# Altium project LPEDT.PrjPcb
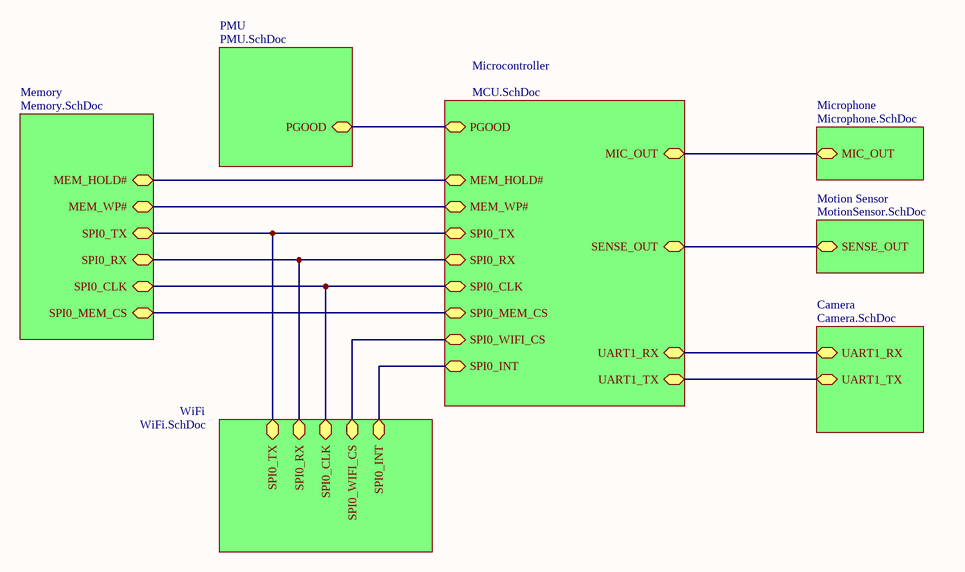
[diagram p0: TopLevel.SchDoc]
8 sheets, 87 parts. Net scope: hierarchical (ports join the sheet entries above them; power ports are global).
Board file: 3ER_PCB.PcbDoc
Sheets:
  TopLevel.SchDoc
    Microcontroller = MCU.SchDoc
    Camera = Camera.SchDoc
    Motion Sensor = MotionSensor.SchDoc
    Microphone = Microphone.SchDoc
    PMU = PMU.SchDoc
    Memory = Memory.SchDoc
    WiFi = WiFi.SchDoc

## Sheet TopLevel.SchDoc: Top-Level Schematic
size A3; Date: 10/18/2017; Author: Chase E Stewart; CompanyName: Three-Eyed Ravens; DrawnBy: Chase E Stewart; Organization: CU Boulder; DocumentNumber: 001; Revision: 1.1; SheetNumber: 1; SheetTotal: 8; Application_BuildNumber: 1.0

### Sub-sheets
Camera = Camera.SchDoc: UART1_RX, UART1_TX
Memory = Memory.SchDoc: SPI0_RX, SPI0_CLK, SPI0_MEM_CS, SPI0_TX, MEM_WP#, MEM_HOLD#
Microcontroller = MCU.SchDoc: UART1_RX, UART1_TX, MIC_OUT, SENSE_OUT, SPI0_WIFI_CS, SPI0_MEM_CS, SPI0_CLK, SPI0_RX, SPI0_TX, MEM_WP#, MEM_HOLD#, SPI0_INT, PGOOD
Microphone = Microphone.SchDoc: MIC_OUT
Motion Sensor = MotionSensor.SchDoc: SENSE_OUT
PMU = PMU.SchDoc: PGOOD
WiFi = WiFi.SchDoc: SPI0_TX, SPI0_RX, SPI0_CLK, SPI0_WIFI_CS, SPI0_INT

### Nets
MEM_HOLD#: sheet Microcontroller/MEM_HOLD#, sheet Memory/MEM_HOLD#
MEM_WP#: sheet Microcontroller/MEM_WP#, sheet Memory/MEM_WP#
SPI0_CLK: sheet Microcontroller/SPI0_CLK, sheet Memory/SPI0_CLK, sheet WiFi/SPI0_CLK
SPI0_INT: sheet Microcontroller/SPI0_INT, sheet WiFi/SPI0_INT
SPI0_MEM_CS: sheet Microcontroller/SPI0_MEM_CS, sheet Memory/SPI0_MEM_CS
SPI0_RX: sheet Microcontroller/SPI0_RX, sheet Memory/SPI0_RX, sheet WiFi/SPI0_RX
SPI0_TX: sheet Microcontroller/SPI0_TX, sheet Memory/SPI0_TX, sheet WiFi/SPI0_TX
SPI0_WIFI_CS: sheet Microcontroller/SPI0_WIFI_CS, sheet WiFi/SPI0_WIFI_CS
UART1_RX: sheet Microcontroller/UART1_RX, sheet Camera/UART1_RX
UART1_TX: sheet Microcontroller/UART1_TX, sheet Camera/UART1_TX
NetC26_1: sheet Microcontroller/MIC_OUT, sheet Microphone/MIC_OUT
NetP12_1: sheet Microcontroller/PGOOD, sheet PMU/PGOOD
NetR9_2: sheet Microcontroller/SENSE_OUT, sheet Motion Sensor/SENSE_OUT

### Notes on the sheet
- Title
- Size:
- Date:
- A3
- Number:
- Time:
- Revision:
- Sheet
- of
- File:

## Sheet MCU.SchDoc: MCU
size A3; Organization: CU Boulder; DocumentNumber: 003; Revision: 1.1; SheetNumber: 3; SheetTotal: 8
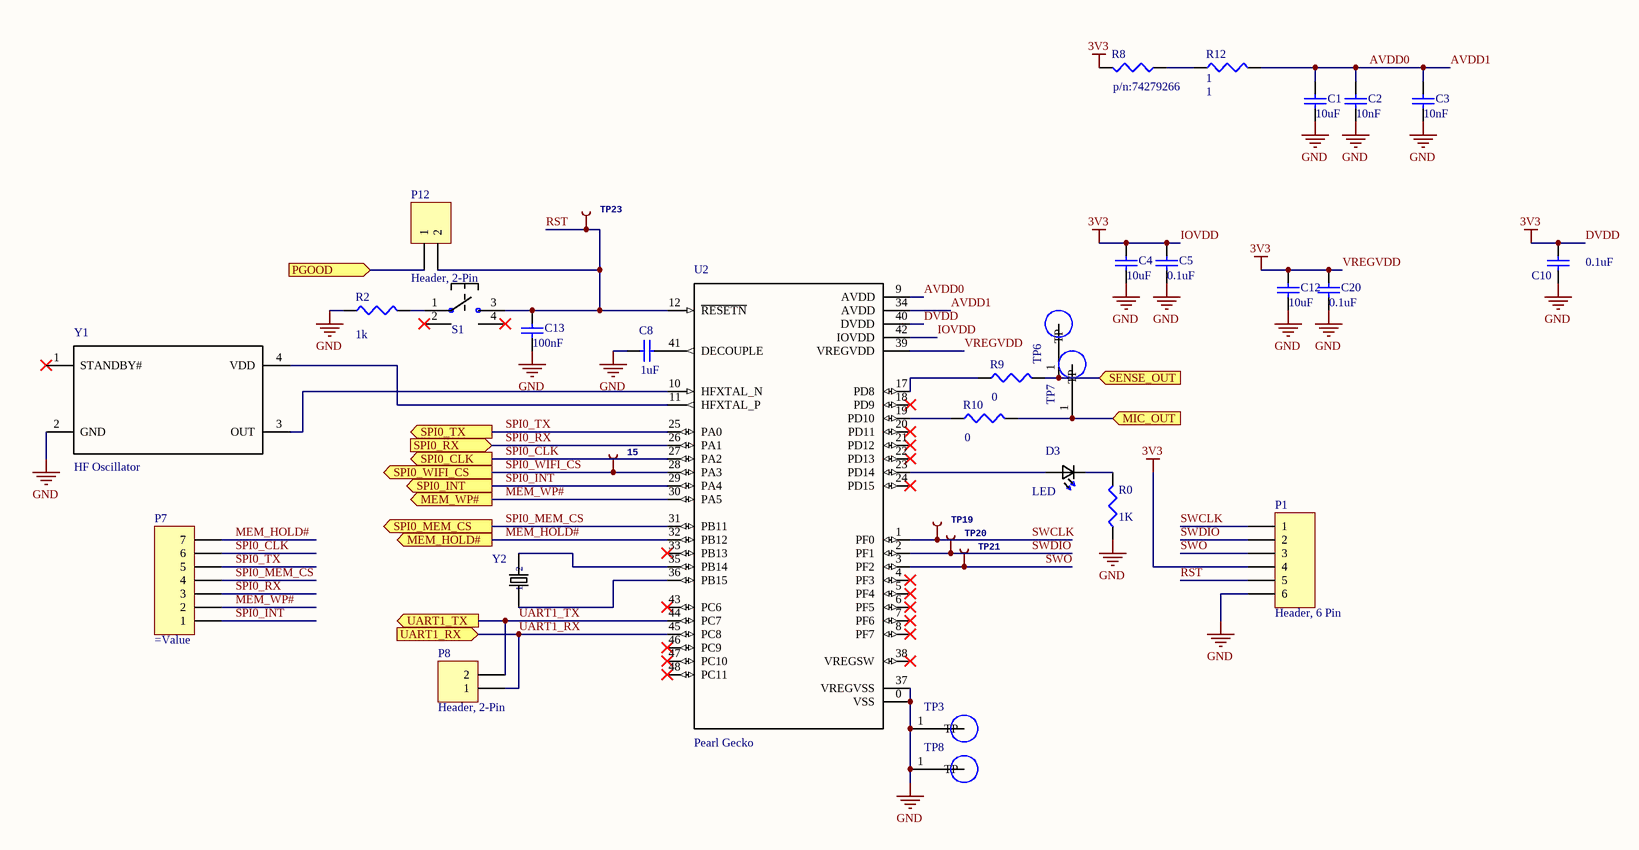
[diagram p1: MCU.SchDoc]

### Parts
15  SparkFun Test Points  [PAD.02X.02]  (value not drawn)
C1  10uF  [1608[0603]]
C2  10nF  [1608[0603]]
C3  10nF  [1608[0603]]
C4  10uF  [1608[0603]]
C5  0.1uF  [1608[0603]]
C8  1uF  [1608[0603]]
C10  0.1uF  [1608[0603]]
C12  10uF  [1608[0603]]
C13  100nF  [1608[0603]]
C20  0.1uF  [1608[0603]]
D3  LED  [0603_TLMO1100-GS08(Primary)]
P1  Header, 6 Pin  [HDR1X6]
P7  (no value)  [HDR1X7]
P8  Header, 2-Pin  [HDR1X2]
P12  Header, 2-Pin  [HDR1X2]
R0  1K  [J1-0603]
R2  1k  [J1-0603]
R8  value p/n:74279266  [J1-0603]  (hidden comment: Ferrite Bead)
R9  0  [J1-0603]
R10  0  [J1-0603]
R12  1  [J1-0603]
S1  Button  [TL3315NF100Q]  (value not drawn)
TP3  Test Points  [TP380X203]  (value not drawn)
TP6  Test Points  [TP380X203]  (value not drawn)
TP7  Test Points  [TP380X203]  (value not drawn)
TP8  Test Points  [TP380X203]  (value not drawn)
TP19  SparkFun Test Points  [PAD.02X.02]  (value not drawn)
TP20  SparkFun Test Points  [PAD.02X.02]  (value not drawn)
TP21  SparkFun Test Points  [PAD.02X.02]  (value not drawn)
TP23  SparkFun Test Points  [PAD.02X.02]  (value not drawn)
U2  Pearl Gecko  [QFN50P700X700X90-49N]
Y1  HF Oscillator  [OSCSC320X250X100N]
Y2  LF Oscillator  [XTAL320X150X90N]  (value not drawn)

### Ports
MEM_HOLD# (out), MEM_WP# (out), MIC_OUT (in), PGOOD (in), SENSE_OUT (in), SPI0_CLK (out), SPI0_INT (out), SPI0_MEM_CS (out), SPI0_RX (in), SPI0_TX (out), SPI0_WIFI_CS (out), UART1_RX (in), UART1_TX (out)

### Nets
DVDD: C4.2 C5.2 C10.2 C12.2 C20.2 P1.4 R8.2 U2.39(VREGVDD) U2.40(DVDD) U2.42(IOVDD)  [also labelled 3V3, IOVDD, VREGVDD]
GND: C1.1 C2.1 C3.1 C4.1 C5.1 C8.2 C10.1 C12.1 C13.1 C20.1 P1.6 R0.1 R2.1 TP3.1(TP) TP8.1(TP) U2.0(VSS) U2.37(VREGVSS) Y1.2(GND)
AVDD0: C1.2 C2.2 C3.2 R12.2 U2.9(AVDD) U2.34(AVDD)  [also labelled AVDD1]
MEM_HOLD#: P7.7 U2.32(PB12) ; port MEM_HOLD#
MEM_WP#: P7.2 U2.30(PA5) ; port MEM_WP#
RST: C13.2 P1.5 P12.2 S1.3(P$2) TP23.P$1 U2.12(~{RESETN})
SPI0_CLK: P7.6 U2.27(PA2) ; port SPI0_CLK
SPI0_INT: P7.1 U2.29(PA4) ; port SPI0_INT
SPI0_MEM_CS: P7.4 U2.31(PB11) ; port SPI0_MEM_CS
SPI0_RX: P7.3 U2.26(PA1) ; port SPI0_RX
SPI0_TX: P7.5 U2.25(PA0) ; port SPI0_TX
SPI0_WIFI_CS: 15.P$1 U2.28(PA3) ; port SPI0_WIFI_CS
SWCLK: P1.1 TP19.P$1 U2.1(PF0)
SWDIO: P1.2 TP20.P$1 U2.2(PF1)
SWO: P1.3 TP21.P$1 U2.3(PF2)
UART1_RX: P8.1 U2.45(PC8) ; port UART1_RX
UART1_TX: P8.2 U2.44(PC7) ; port UART1_TX
NetC8_1: C8.1 U2.41(DECOUPLE)
NetC26_1: R10.2 TP7.1(TP) ; port MIC_OUT
NetD3_1: D3.1(A2) U2.23(PD14)
NetD3_2: D3.2(K2) R0.2
NetP12_1: P12.1 ; port PGOOD
NetR2_2: R2.2 S1.1(P$1)
NetR8_1: R8.1 R12.1
NetR9_1: R9.1 U2.17(PD8)
NetR9_2: R9.2 TP6.1(TP) ; port SENSE_OUT
NetR10_1: R10.1 U2.19(PD10)
NetU2_10: U2.10(HFXTAL_N) Y1.3(OUT)
NetU2_11: U2.11(HFXTAL_P) Y1.4(VDD)
NetU2_35: U2.35(PB14) Y2.2
NetU2_36: U2.36(PB15) Y2.1

Not connected (* = marked no-connect by the designer): S1 2(P$1)* 4(P$2)*; U2 4(PF3)* 5(PF4)* 6(PF5)* 7(PF6)* 8(PF7)* 18(PD9)* 20(PD11)* 21(PD12)* 22(PD13)* 24(PD15)* 33(PB13)* 38(VREGSW)* 43(PC6)* 46(PC9)* 47(PC10)* 48(PC11)*; Y1 1(STANDBY#)*

### Notes on the sheet
- Title
- Size:
- Date:
- A3
- Number:
- Time:
- Revision:
- Sheet
- of
- File:

### Library data of the parts
15 TP19-TP21 TP23 = TEST-POINT2: Supplier 1: Digi-Key
  15 TP20 TP21: Supplier Part Number 1: 36-5019CT-ND
  TP19 TP23: Supplier Part Number 1: 36-5019DKR-ND
C1-C5 C8 C10 C13 C20 = Cap Semi: Capacitor (Semiconductor SIM Model); Published: 8-Jun-2000; LatestRevisionDate: 29-May-2009; LatestRevisionNote: IPC-7351 Footprint Added.; PackageReference: C1206; Publisher: Altium Limited; PackageDescription: Chip Capacitor; Supplier 1: Digi-Key
  C1: Value: 10uF; Supplier Part Number 1: 1276-1948-1-ND
  C2: Value: 10nF; Supplier Part Number 1: 311-1085-1-ND
  C3: Value: 10nF; Supplier Part Number 1: 311-1085-6-ND
  C4: Value: 10uF; Supplier Part Number 1: 1276-1948-6-ND
  C5 C10 C20: Value: 0.1uF; Supplier Part Number 1: 311-1088-6-ND
  C8: Value: 1uF; Supplier Part Number 1: 1276-1946-6-ND
  C13: Value: 100nF; Supplier Part Number 1: 311-1088-1-ND
C12 = Cap Semi: Capacitor (Semiconductor SIM Model); Manufacturer: Samsung; Manufacturer Part Number: CL10B106MQ8NRNC; Capacitance: 10 µF; Dielectric: X7R; Tolerance (%): ±20 %; Rated Voltage: 6.3 V; Published: 8-Jun-2000; LatestRevisionDate: 29-May-2009; LatestRevisionNote: IPC-7351 Footprint Added.; PackageReference: C1206; Publisher: Altium Limited; PackageDescription: Chip Capacitor; Value: 10uF; Supplier 1: Digi-Key; Supplier Part Number 1: 1276-1948-6-ND; Supplier 2: Digi-Key; Supplier Part Number 2: 1276-1948-1-ND; Stock 2: 193796; Pricing 2: 1=0.94, 10=0.715, 100=0.5115, 500=0.396, 1000=0.341 (USD); Case Size/Dimension: 0603; ComponentLink1URL: https://datasheet.ciiva.com/25723/cl10b106mq8nrnc-25723233.pdf; ComponentLink1Description: https://datasheet.ciiva.com/25723/cl10b106mq8nrnc-25723233.pdf; ComponentLink2URL: https://datasheet.ciiva.com/16428/cl10b106mq8nrnc-16428858.pdf; ComponentLink2Description: https://datasheet.ciiva.com/16428/cl10b106mq8nrnc-16428858.pdf
D3 = TLMO1100-GS08: Orange 0603 160Â° 80 mcd 2.1 V 30 mA Non Diffused Surface Mount LED; MF: Vishay; MP: TLMO1100-GS08; Digi-Key_Part_Number: 751-1174-1-ND; Package: 0603 Vishay; Digi-Key_Purchase_URL: https://www.digikey.com/product-detail/en/vishay-semiconductor-opto-division/TLMO1100-GS08/751-1174-1-ND/1681457?WT.z_cid=ref_snapeda; Value: *; Supplier 1: Digi-Key; Supplier Part Number 1: 751-1174-6-ND
P1 = Header 6: Header, 6-Pin; LatestRevisionDate: 17-Jul-2002; LatestRevisionNote: Re-released for DXP Platform.; Publisher: Altium Limited; Supplier 1: Digi-Key; Supplier Part Number 1: 732-5327-ND
P7 = Header 7: Header, 7-Pin; LatestRevisionDate: 17-Jul-2002; LatestRevisionNote: Re-released for DXP Platform.; Publisher: Altium Limited; Supplier 1: Digi-Key; Supplier Part Number 1: 732-5327-ND
P8 P12 = Header 2: LatestRevisionDate: 17-Jul-2002; LatestRevisionNote: Re-released for DXP Platform.; Publisher: Altium Limited; Supplier 1: Digi-Key; Supplier Part Number 1: 732-5327-ND
R0 R2 R8-R10 R12 = Res3: Resistor; Published: 8-Jun-2000; LatestRevisionDate: 29-May-2009; LatestRevisionNote: IPC-7351 Footprint Added.; PackageReference: J1-0603; Publisher: Altium Limited; PackageDescription: Chip Resistor; Supplier 1: Digi-Key
  R0: Value: 1K; Supplier Part Number 1: 311-0.0GRDKR-ND
  R2: Value: 1k; Supplier Part Number 1: 311-1.0KGRCT-ND
  R8: Supplier Part Number 1: 732-4484-1-ND
  R9 R10: Value: 0; Supplier Part Number 1: 311-0.0GRDKR-ND
  R12: Value: 1; Supplier Part Number 1: 311-1.00HRDKR-ND
S1 = TL3315NF100Q: TL3315 Series SPST 1 N Round Button J-Bend SMT Low Profile Tactile Switch; MF: E-Switch; Price: 0.13 USD; Package: None; Availability: Good; MP: TL3315NF100Q; Value: *
TP3 TP6-TP8 = 5019: Phosphor Bronze Contact Miniature Silver Plated Surface Mount Test Points; MF: Keystone; Digi-Key_Part_Number: 36-5019CT-ND; Digi-Key_Purchase_URL: https://www.digikey.com/product-detail/en/keystone-electronics/5019/36-5019CT-ND/3907344?WT.z_cid=ref_snapeda; MP: 5019; Package: None; Value: *; Supplier 1: Digi-Key
  TP3: Supplier Part Number 1: 36-5019CT-ND
  TP6-TP8: Supplier Part Number 1: 36-5019DKR-ND
U2 = EFM32PG12B500F1024GM48-B: MCU 32-bit ARM Cortex M4 RISC 1024KB Flash 3.3V 48-Pin QFN EP; MF: Silicon Labs; MP: EFM32PG12B500F1024GM48-B; Package: QFN-48 Silicon Labs; Price: 5.00 USD; Availability: Warning; Value: *; Supplier 1: Digi-Key; Supplier Part Number 1: 336-3941-ND
Y1 = ASFLMB-40.000MHZ-LR-T: Oscillator MEMS 40MHz ?25ppm (Stability) 15pF 55% 1.8V/2.5V/3.3V Automotive 4-Pin QFN SMD T/R; MF: Abracon; Availability: Good; Price: 1.39 USD; MP: ASFLMB-40.000MHZ-LR-T; Package: SMD-4 Abracon; Value: *; Supplier 1: Digi-Key; Supplier Part Number 1: 535-11000-1-ND
Y2 = ECS-.327-12.5-34B-TR: MF: ECS International; Package: SMD-2 ECS International; Digi-Key_Purchase_URL: https://www.digikey.com/product-detail/en/ecs-inc/ECS-.327-12.5-34B-TR/XC1617CT-ND/1693786?WT.z_cid=ref_snapeda; Digi-Key_Part_Number: XC1617CT-ND; MP: ECS-.327-12.5-34B-TR; Value: *; Supplier 1: Mouser; Supplier Part Number 1: 520-ECS-327-12.5-34B

## Sheet Camera.SchDoc: Camera
size A3; CompanyName: CU Boulder; Organization: CU Boulder; DocumentNumber: 002; Revision: 1.1; SheetNumber: 2; SheetTotal: 8; ProjectName: PanoptiNode
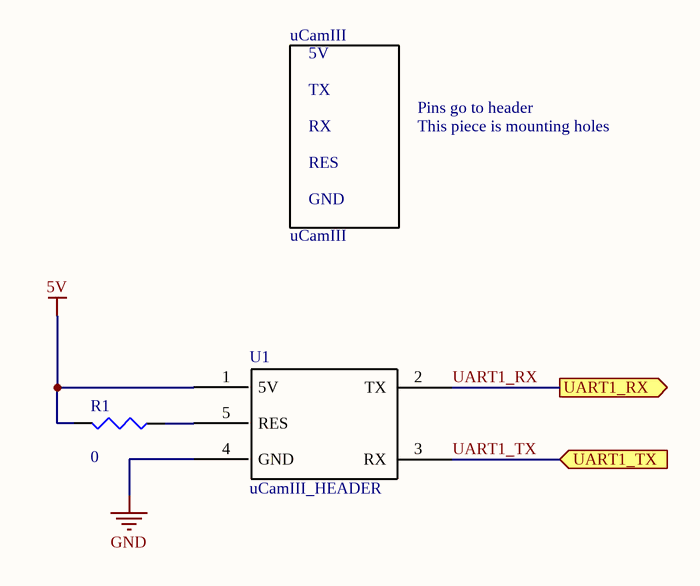
[diagram p2: Camera.SchDoc]

### Parts
R1  0  [J1-0603]
U1  uCamIII_HEADER  [uCamIII_Header]
uCamIII  uCamIII  [uCamIII]

### Ports
UART1_RX (out), UART1_TX (in)

### Nets
5V: R1.2 U1.1(5V)
GND: U1.4(GND)
UART1_RX: U1.2(TX) ; port UART1_RX
UART1_TX: U1.3(RX) ; port UART1_TX
NetR1_1: R1.1 U1.5(RES)

### Notes on the sheet
- Title
- Size:
- Date:
- A3
- Number:
- Time:
- Revision:
- Sheet
- of
- File:
- (in symbol uCamIII) 5V; TX; Pins go to header; RX; This piece is mounting holes; RES; GND

### Library data of the parts
R1 = Res3: Resistor; Published: 8-Jun-2000; LatestRevisionDate: 29-May-2009; LatestRevisionNote: IPC-7351 Footprint Added.; PackageReference: J1-0603; Publisher: Altium Limited; PackageDescription: Chip Resistor; Value: 0; Supplier 1: Digi-Key; Supplier Part Number 1: 311-0.0GRDKR-ND
U1 = uCamIII_HEADER: just a pin header for components; Supplier 1: Digi-Key; Supplier Part Number 1: 1613-1369-ND

## Sheet MotionSensor.SchDoc: MotionSensor
size A3; Organization: CU Boulder; DocumentNumber: 006; Revision: 1.1; SheetNumber: 6; SheetTotal: 8
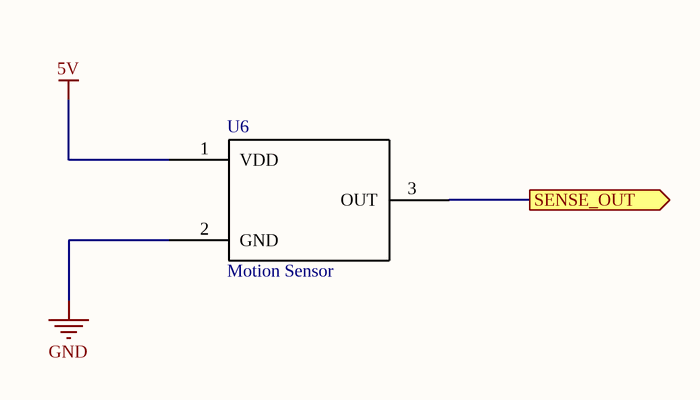
[diagram p3: MotionSensor.SchDoc]

### Parts
U6  Motion Sensor  [AMN24112]

### Ports
SENSE_OUT (out)

### Nets
5V: U6.1(VDD)
GND: U6.2(GND)
NetR9_2: U6.3(OUT) ; port SENSE_OUT

### Notes on the sheet
- Title
- Size:
- Date:
- A3
- Number:
- Time:
- Revision:
- Sheet
- of
- File:

### Library data of the parts
U6 = AMN24112: Supplier 1: Digi-Key; Supplier Part Number 1: 255-1818-ND

## Sheet Microphone.SchDoc: Microphone
size A3; Organization: CU Boulder; DocumentNumber: 005; Revision: 1.1; SheetNumber: 5; SheetTotal: 8
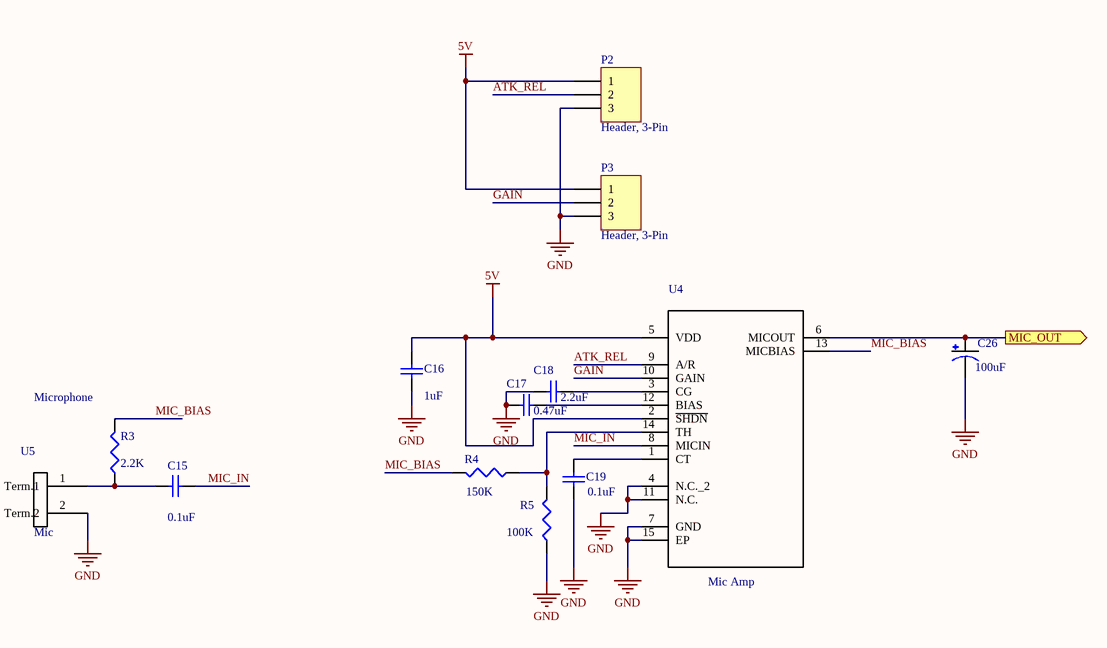
[diagram p4: Microphone.SchDoc]

### Parts
C15  0.1uF  [1608[0603]]
C16  1uF  [1608[0603]]
C17  0.47uF  [1608[0603]]
C18  2.2uF  [1608[0603]]
C19  0.1uF  [1608[0603]]
C26  100uF  [CAPAE1050X1050N]
P2  Header, 3-Pin  [HDR1X3]
P3  Header, 3-Pin  [HDR1X3]
R3  2.2K  [J1-0603]
R4  150K  [J1-0603]
R5  100K  [J1-0603]
U4  Mic Amp  [DFN300X300X80-15N]
U5  Mic  [CMA-4544PF-W]

### Ports
MIC_OUT (out)

### Nets
5V: C16.2 P2.1 P3.1 U4.2(~{SHDN}) U4.5(VDD)
GND: C16.1 C17.2 C18.2 C19.1 C26.2(NEG) P2.3 P3.3 R5.1 U4.4(N.C._2) U4.7(GND) U4.11(N.C.) U4.15(EP) U5.2(Term.2)
ATK_REL: P2.2 U4.9(A/R)
GAIN: P3.2 U4.10(GAIN)
MIC_BIAS: R3.2 R4.2 U4.13(MICBIAS)
MIC_IN: C15.2 U4.8(MICIN)
NetC15_1: C15.1 R3.1 U5.1(Term.1)
NetC17_1: C17.1 U4.12(BIAS)
NetC18_1: C18.1 U4.3(CG)
NetC19_2: C19.2 U4.1(CT)
NetC26_1: C26.1(POS) U4.6(MICOUT) ; port MIC_OUT
NetR4_1: R4.1 R5.2 U4.14(TH)

### Notes on the sheet
- (near R3) Microphone
- Title
- Size:
- Date:
- A3
- Number:
- Time:
- Revision:
- Sheet
- of
- File:

### Library data of the parts
C15-C19 = Cap Semi: Capacitor (Semiconductor SIM Model); Published: 8-Jun-2000; LatestRevisionDate: 29-May-2009; LatestRevisionNote: IPC-7351 Footprint Added.; PackageReference: C1206; Publisher: Altium Limited; PackageDescription: Chip Capacitor; Supplier 1: Digi-Key
  C15 C19: Value: 0.1uF; Supplier Part Number 1: 311-1088-1-ND
  C16: Value: 1uF; Supplier Part Number 1: 1276-1946-1-ND
  C17: Value: 0.47uF; Supplier Part Number 1: 490-3295-1-ND
  C18: Value: 2.2uF; Supplier Part Number 1: 587-2983-6-ND
C26 = MAL214699103E3: 146 CTI Series 50 V 100 uF 10 x 10 x 10 mm SMT CAN Electrolytic Capacitor; MF: Vishay; Price: 1.31 USD; Package: Radial Vishay; Availability: Good; MP: MAL214699103E3; Value: 100uF; Supplier 1: Digi-Key; Supplier Part Number 1: 4437PHCT-ND
P2 P3 = Header 3: LatestRevisionDate: 17-Jul-2002; LatestRevisionNote: Re-released for DXP Platform.; Publisher: Altium Limited
R3-R5 = Res3: Resistor; Published: 8-Jun-2000; LatestRevisionDate: 29-May-2009; LatestRevisionNote: IPC-7351 Footprint Added.; PackageReference: J1-0603; Publisher: Altium Limited; PackageDescription: Chip Resistor
  R3: Value: 2.2K
  R4: Value: 150K; Supplier 1: Digi-Key; Supplier Part Number 1: 311-1088-1-ND
  R5: Value: 100K; Supplier 1: Digi-Key; Supplier Part Number 1: 311-100KHRCT-ND
U4 = MAX9814ETD+T: Audio Amp Microphone 1-CH Mono Class-AB 14-Pin TDFN EP T/R; MF: Maxim Integrated; Price: 0.92 USD; MP: MAX9814ETD+T; Package: TDFN-14 Maxim Integrated; Availability: Good; Value: *; Supplier 1: Digi-Key; Supplier Part Number 1: MAX9814ETD+TDKR-ND
U5 = Component_1: Supplier 1: Digi-Key; Supplier Part Number 1: 102-1721-ND

## Sheet PMU.SchDoc: Power Management
size A3; Organization: CU Boulder; DocumentNumber: 007; Revision: 1.1; SheetNumber: 7; SheetTotal: 8
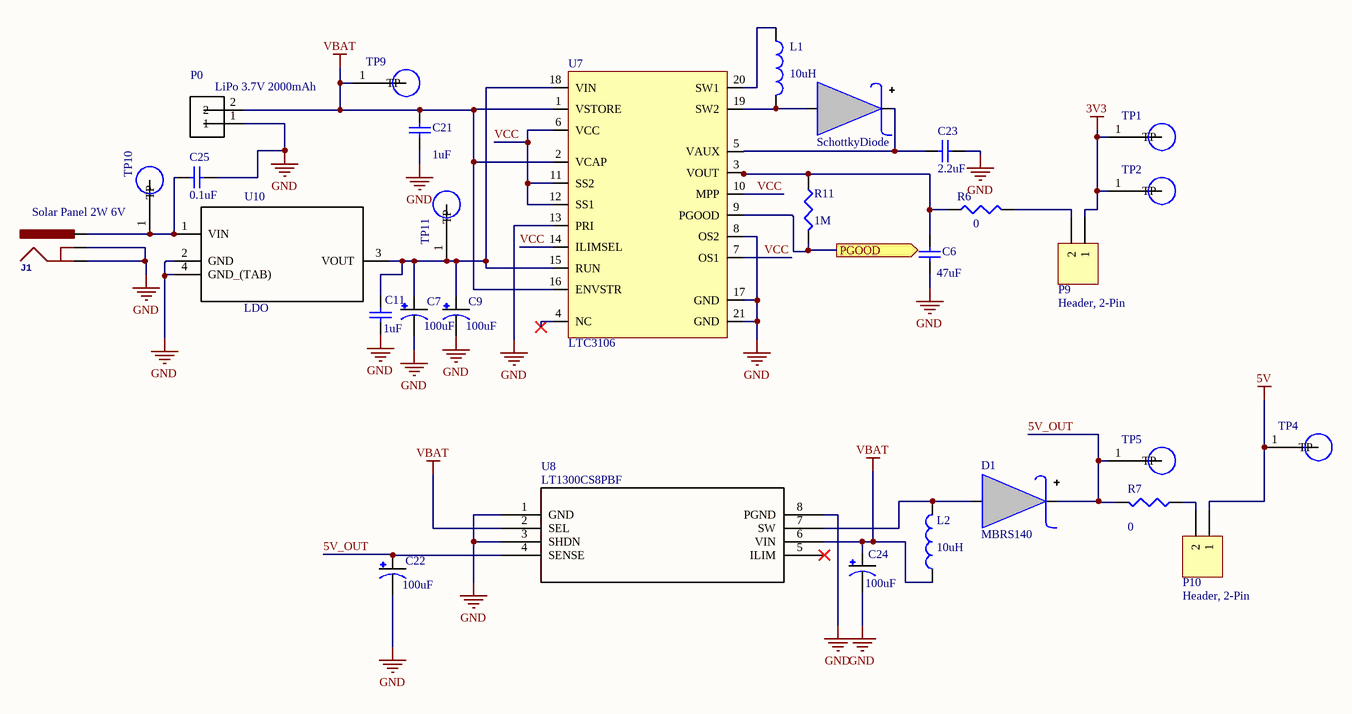
[diagram p5: PMU.SchDoc]

### Parts
C6  47uF  [1608[0603]]
C7  100uF  [CAPAE1050X1050N]
C9  100uF  [CAPAE1050X1050N]
C11  1uF  [1608[0603]]
C21  1uF  [1608[0603]]
C22  100uF  [CAPAE1050X1050N]
C23  2.2uF  [1608[0603]]
C24  100uF  [CAPAE1050X1050N]
C25  0.1uF  [1608[0603]]
D1  MBRS140  [DO-214AC]
J1  Power Jack  [POWER_JACK_SMD]  (value not drawn)
L1  10uH  [INDM7366X500]
L2  10uH  [INDM7366X500]
P0  Battery Connector  [JST_B2B-PH-SM4-TB]  (value not drawn)
P9  Header, 2-Pin  [HDR1X2]
P10  Header, 2-Pin  [HDR1X2]
R6  0  [J1-0603]
R7  0  [J1-0603]
R11  1M  [J1-0603]
SchottkyDiode  SOD2513X120N  [SOD2513X120N]  (value not drawn)
TP1  Test Points  [TP380X203]  (value not drawn)
TP2  Test Points  [TP380X203]  (value not drawn)
TP4  Test Points  [TP380X203]  (value not drawn)
TP5  Test Points  [TP380X203]  (value not drawn)
TP9  Test Points  [TP380X203]  (value not drawn)
TP10  Test Points  [TP380X203]  (value not drawn)
TP11  Test Points  [TP380X203]  (value not drawn)
U7  LTC3106  [LTC3106]
U8  LT1300CS8PBF  [SOIC-8_S]
U10  LDO  [SOT230P700X180-4N]

### Ports
PGOOD (out)

### Nets
3V3: P9.1 TP1.1(TP) TP2.1(TP)  [project net DVDD]
5V: P10.1 TP4.1(TP)
GND: C6.1 C7.2(NEG) C9.2(NEG) C11.1 C21.1 C22.2(NEG) C23.1 C24.2(NEG) C25.1 J1.GND(GNDBREAK) J1.P$4(GND) P0.1 U7.8(OS2) U7.13(PRI) U7.17(GND) U7.21(GND) U8.1(GND) U8.3(SHDN) U8.8(PGND) U10.2(GND) U10.4(GND_(TAB))
VBAT: C21.2 C24.1(POS) L2.1 P0.2 TP9.1(TP) U7.1(VSTORE) U7.2(VCAP) U7.16(ENVSTR) U8.2(SEL) U8.6(VIN)
5V_OUT: C22.1(POS) D1.2 R7.2 TP5.1(TP) U8.4(SENSE)
VCC: U7.6(VCC) U7.7(OS1) U7.10(MPP) U7.11(SS2) U7.12(SS1) U7.14(ILIMSEL)
NetC6_2: C6.2 R6.1 R11.1 U7.3(VOUT)
NetC7_1: C7.1(POS) C9.1(POS) C11.2 TP11.1(TP) U7.15(RUN) U7.18(VIN) U10.3(VOUT)
NetC23_2: C23.2 SchottkyDiode.2 U7.5(VAUX)
NetC25_2: C25.2 J1.VIN0(PWR) TP10.1(TP) U10.1(VIN)
NetD1_1: D1.1 L2.2 U8.7(SW)
NetL1_1: L1.1 U7.20(SW1)
NetL1_2: L1.2 SchottkyDiode.1 U7.19(SW2)
NetP9_2: P9.2 R6.2
NetP10_2: P10.2 R7.1
NetP12_1: R11.2 U7.9(PGOOD) ; port PGOOD

Not connected (* = marked no-connect by the designer): U7 4(NC)*; U8 5(ILIM)*

### Notes on the sheet
- (near P0) LiPo 3.7V 2000mAh
- Solar Panel 2W 6V
- Title
- Size:
- Date:
- A3
- Number:
- Time:
- Revision:
- Sheet
- of
- File:

### Library data of the parts
C6 C11 C21 C23 C25 = Cap Semi: Capacitor (Semiconductor SIM Model); Published: 8-Jun-2000; LatestRevisionDate: 29-May-2009; LatestRevisionNote: IPC-7351 Footprint Added.; PackageReference: C1206; Publisher: Altium Limited; PackageDescription: Chip Capacitor; Supplier 1: Digi-Key
  C6: Value: 47uF; Supplier Part Number 1: 478-11180-2-ND
  C11 C21: Value: 1uF; Supplier Part Number 1: 1276-1946-6-ND
  C23: Value: 2.2uF; Supplier Part Number 1: 587-2983-6-ND
  C25: Value: 0.1uF; Supplier Part Number 1: 311-1088-6-ND
C7 C9 C22 C24 = MAL214699103E3: as C26 on sheet Microphone; Price: 1.31 USD; Package: Radial Vishay; Availability: Good; MP: MAL214699103E3; Value: 100uF; Supplier 1: Digi-Key; Supplier Part Number 1: 4437PHCT-ND
J1 = POWER_JACKSMD: PROD_ID: CONN-08106; SF_ID: PRT-12748
L1 L2 = Inductor: Code_IEC: 1005; Published: 8-Jun-2000; LatestRevisionDate: 29-May-2009; LatestRevisionNote: IPC-7351 Footprint Added.; PackageReference: 0402-A; Publisher: Altium Limited; PackageDescription: Chip Inductor; Code_JEITA: 0402; Value: 10uH; Supplier 1: Digi-Key; Supplier Part Number 1: 732-1025-1-ND
P0 = B2B-PH-SM4-TB: MF: JST; Package: None; MP: B2B-PH-SM4-TB; Availability: Unavailable; Price: 0.23 USD; Value: *
P9 P10 = Header 2: LatestRevisionDate: 17-Jul-2002; LatestRevisionNote: Re-released for DXP Platform.; Publisher: Altium Limited; Supplier 1: Digi-Key; Supplier Part Number 1: 732-5327-ND
R6 R7 R11 = Res3: Resistor; Published: 8-Jun-2000; LatestRevisionDate: 29-May-2009; LatestRevisionNote: IPC-7351 Footprint Added.; PackageReference: J1-0603; Publisher: Altium Limited; PackageDescription: Chip Resistor; Supplier 1: Digi-Key
  R6 R7: Value: 0; Supplier Part Number 1: 732-4484-6-ND
  R11: Value: 1M; Supplier Part Number 1: 311-1.00MHRDKR-ND
TP1 TP2 TP4 TP5 TP9-TP11 = 5019: as TP3 on sheet MCU; Digi-Key_Part_Number: 36-5019CT-ND; Digi-Key_Purchase_URL: https://www.digikey.com/product-detail/en/keystone-electronics/5019/36-5019CT-ND/3907344?WT.z_cid=ref_snapeda; MP: 5019; Package: None; Value: *; Supplier 1: Digi-Key
  TP1 TP2 TP10: Supplier Part Number 1: 36-5019DKR-ND
  TP4 TP5 TP9 TP11: Supplier Part Number 1: 36-5019CT-ND
U8 = LT1300CS8PBF: PMIC - DC/DC voltage regulator Linear Technology LT1300CS8%23PBF Boost%2C Converter/amplifier SOIC 8; MP: LT1300CS8#PBF; Availability: Warning; Package: SO-8 Linear Technology; MF: Linear Technology; Price: 4.13 USD; Value: *
U10 = LM2937IMPX-5.0/NOPB: LDO Regulator Pos 5V 0.5A Automotive 4-Pin(3+Tab) SOT-223 T/R; MF: Texas Instruments; Package: SOT-223 Texas Instruments; Availability: Good; MP: LM2937IMPX-5.0/NOPB; Price: 1.07 USD; Value: *; Supplier 1: Digi-Key; Supplier Part Number 1: LT1300CS8#PBF-ND
D1 = MBRS140: Supplier 1: Digi-Key; Supplier Part Number 1: MBRS140T3GOSDKR-ND
SchottkyDiode = SOD2513X120N: Supplier 1: Digi-Key; Supplier Part Number 1: ZLLS400TADKR-ND
U7 = LTC3106: Supplier 1: Digi-Key; Supplier Part Number 1: LTC3106EUDC#PBF-ND

## Sheet Memory.SchDoc: Memory
size A3; Organization: CU Boulder; DocumentNumber: 004; Revision: 1.1; SheetNumber: 4; SheetTotal: 8
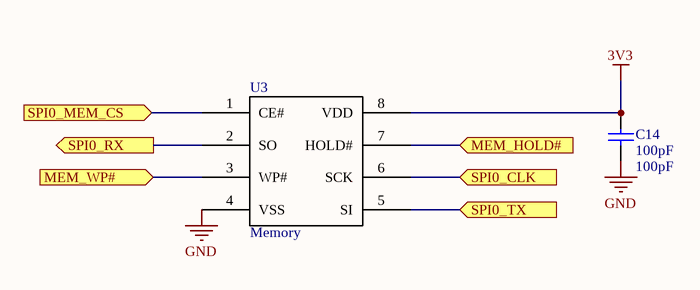
[diagram p6: Memory.SchDoc]

### Parts
C14  100pF  [1608[0603]]
U3  Memory  [SST25VF010A]

### Ports
MEM_HOLD# (in), MEM_WP# (in), SPI0_CLK (in), SPI0_MEM_CS (in), SPI0_RX (out), SPI0_TX (in)

### Nets
3V3: C14.2 U3.8(VDD)  [project net DVDD]
GND: C14.1 U3.4(VSS)
MEM_HOLD#: U3.7(HOLD#) ; port MEM_HOLD#
MEM_WP#: U3.3(WP#) ; port MEM_WP#
SPI0_CLK: U3.6(SCK) ; port SPI0_CLK
SPI0_MEM_CS: U3.1(CE#) ; port SPI0_MEM_CS
SPI0_RX: U3.2(SO) ; port SPI0_RX
SPI0_TX: U3.5(SI) ; port SPI0_TX

### Notes on the sheet
- Title
- Size:
- Date:
- A3
- Number:
- Time:
- Revision:
- Sheet
- of
- File:

### Library data of the parts
C14 = Cap Semi: Capacitor (Semiconductor SIM Model); Published: 8-Jun-2000; LatestRevisionDate: 29-May-2009; LatestRevisionNote: IPC-7351 Footprint Added.; PackageReference: C1206; Publisher: Altium Limited; PackageDescription: Chip Capacitor; Value: 100pF; Supplier 1: Digi-Key; Supplier Part Number 1: 399-7824-1-ND
U3 = SST25VF010A: Supplier 1: Digi-Key; Supplier Part Number 1: SST25VF010A-33-4C-SAE-ND

## Sheet WiFi.SchDoc: WiFi
size A3; Organization: CU Boulder; DocumentNumber: 008; Revision: 1.1; SheetNumber: 8; SheetTotal: 8
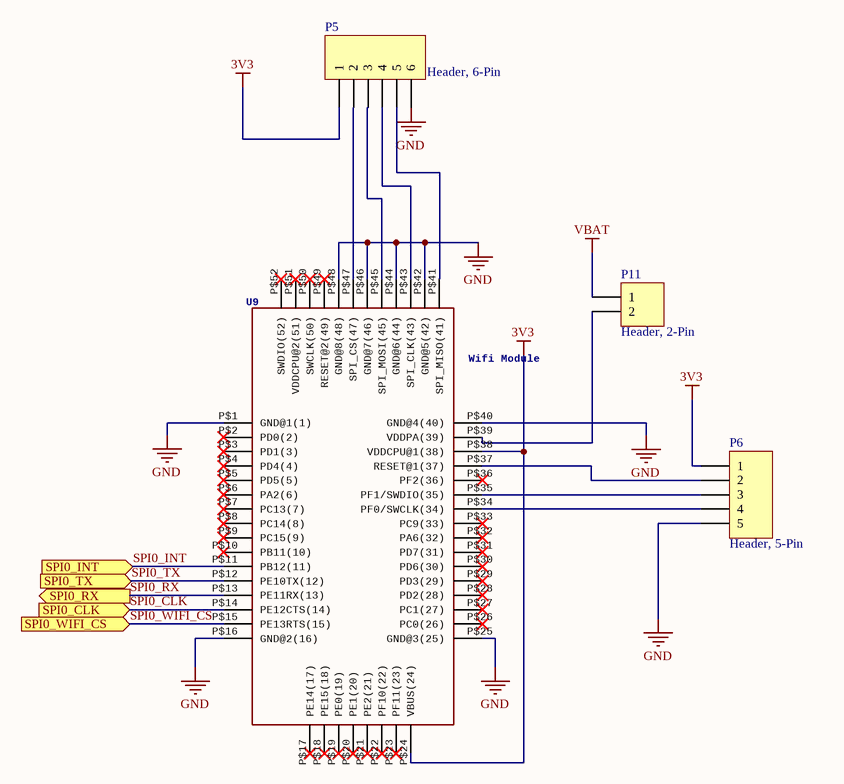
[diagram p7: WiFi.SchDoc]

### Parts
P5  Header, 6-Pin  [HDR1X6]
P6  Header, 5-Pin  [HDR1X5]
P11  Header, 2-Pin  [HDR1X2]
U9  Wifi Module  [WGM110_PAC]

### Ports
SPI0_CLK (in), SPI0_INT (in), SPI0_RX (out), SPI0_TX (in), SPI0_WIFI_CS (in)

### Nets
3V3: P5.1 P6.1 U9.P$24(VBUS(24)) U9.P$38(VDDCPU@1(38))  [project net DVDD]
GND: P5.6 P6.5 U9.P$1(GND@1(1)) U9.P$16(GND@2(16)) U9.P$25(GND@3(25)) U9.P$40(GND@4(40)) U9.P$42(GND@5(42)) U9.P$44(GND@6(44)) U9.P$46(GND@7(46)) U9.P$48(GND@8(48))
VBAT: P11.1
SPI0_CLK: U9.P$14(PE12CTS(14)) ; port SPI0_CLK
SPI0_INT: U9.P$11(PB12(11)) ; port SPI0_INT
SPI0_RX: U9.P$13(PE11RX(13)) ; port SPI0_RX
SPI0_TX: U9.P$12(PE10TX(12)) ; port SPI0_TX
SPI0_WIFI_CS: U9.P$15(PE13RTS(15)) ; port SPI0_WIFI_CS
NetP5_2: P5.2 U9.P$47(SPI_CS(47))
NetP5_3: P5.3 U9.P$45(SPI_MOSI(45))
NetP5_4: P5.4 U9.P$43(SPI_CLK(43))
NetP5_5: P5.5 U9.P$41(SPI_MISO(41))
NetP6_2: P6.2 U9.P$37(RESET@1(37))
NetP6_3: P6.3 U9.P$35(PF1/SWDIO(35))
NetP6_4: P6.4 U9.P$34(PF0/SWCLK(34))
NetP11_2: P11.2 U9.P$39(VDDPA(39))

Not connected (* = marked no-connect by the designer): U9 P$2(PD0(2))* P$3(PD1(3))* P$4(PD4(4))* P$5(PD5(5))* P$6(PA2(6))* P$7(PC13(7))* P$8(PC14(8))* P$9(PC15(9))* P$10(PB11(10))* P$17(PE14(17))* P$18(PE15(18))* P$19(PE0(19))* P$20(PE1(20))* P$21(PE2(21))* P$22(PF10(22))* P$23(PF11(23))* P$26(PC0(26))* P$27(PC1(27))* P$28(PD2(28))* P$29(PD3(29))* P$30(PD6(30))* P$31(PD7(31))* P$32(PA6(32))* P$33(PC9(33))* P$36(PF2(36))* P$49(RESET@2(49))* P$50(SWCLK(50))* P$51(VDDCPU@2(51))* P$52(SWDIO(52))*

### Notes on the sheet
- Title
- Size:
- Date:
- A3
- Number:
- Time:
- Revision:
- Sheet
- of
- File:

### Library data of the parts
P5 = Header 6: LatestRevisionDate: 17-Jul-2002; LatestRevisionNote: Re-released for DXP Platform.; Publisher: Altium Limited
P6 = Header 5: LatestRevisionDate: 17-Jul-2002; LatestRevisionNote: Re-released for DXP Platform.; Publisher: Altium Limited
P11 = Header 2: LatestRevisionDate: 17-Jul-2002; LatestRevisionNote: Re-released for DXP Platform.; Publisher: Altium Limited
U9 = WGM110_DEV: Supplier 1: Digi-Key; Supplier Part Number 1: 336-4136-1-ND; Supplier 2: Digi-Key

## Nets that join several sheets
5V: Camera (R1.2 U1.1), MotionSensor (U6.1), Microphone (5 pins), PMU (P10.1 TP4.1)
DVDD: MCU (10 pins), PMU (P9.1 TP1.1 TP2.1), Memory (C14.2 U3.8), WiFi (P5.1 P6.1 U9.P$24 U9.P$38)
GND: MCU (18 pins), Camera (U1.4), MotionSensor (U6.2), Microphone (13 pins), PMU (21 pins), Memory (C14.1 U3.4), WiFi (10 pins)
VBAT: PMU (10 pins), WiFi (P11.1)
MEM_HOLD#: MCU (P7.7 U2.32), Memory (U3.7)
MEM_WP#: MCU (P7.2 U2.30), Memory (U3.3)
NetC26_1: MCU (R10.2 TP7.1), Microphone (C26.1 U4.6)
NetP12_1: MCU (P12.1), PMU (R11.2 U7.9)
NetR9_2: MCU (R9.2 TP6.1), MotionSensor (U6.3)
SPI0_CLK: MCU (P7.6 U2.27), Memory (U3.6), WiFi (U9.P$14)
SPI0_INT: MCU (P7.1 U2.29), WiFi (U9.P$11)
SPI0_MEM_CS: MCU (P7.4 U2.31), Memory (U3.1)
SPI0_RX: MCU (P7.3 U2.26), Memory (U3.2), WiFi (U9.P$13)
SPI0_TX: MCU (P7.5 U2.25), Memory (U3.5), WiFi (U9.P$12)
SPI0_WIFI_CS: MCU (15.P$1 U2.28), WiFi (U9.P$15)
UART1_RX: MCU (P8.1 U2.45), Camera (U1.2)
UART1_TX: MCU (P8.2 U2.44), Camera (U1.3)